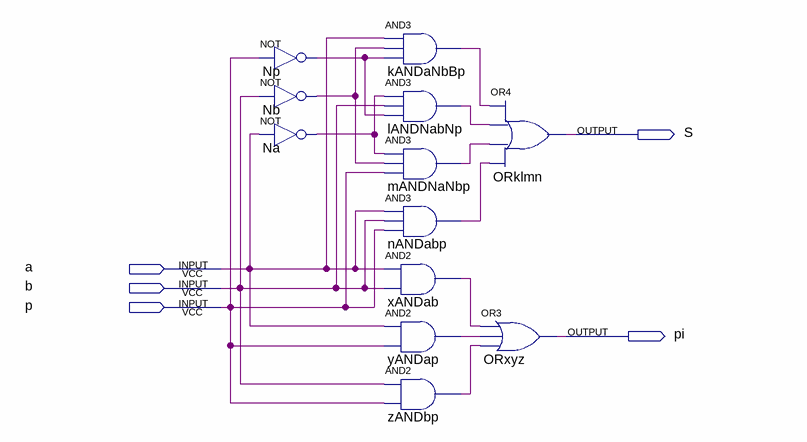
[diagram p0: schematic sheet]
// Quartus schematic sumAND_OR_N.bdf as structural Verilog: 12 symbols, 5 pins
module sumAND_OR_N (
  input  a,
  input  b,
  input  p,
  output S,
  output pi
);

  wire kANDaNbBp_out, lANDNabNp_out, mANDNaNbp_out, Na_out, nANDabp_out, Nb_out, Np_out, xANDab_out,
       yANDap_out, zANDbp_out;

  not Np (Np_out, p);
  not Nb (Nb_out, b);
  not Na (Na_out, a);
  and kANDaNbBp (kANDaNbBp_out, a, Nb_out, Np_out);
  and lANDNabNp (lANDNabNp_out, Na_out, b, Np_out);
  and mANDNaNbp (mANDNaNbp_out, Na_out, Nb_out, p);
  and nANDabp (nANDabp_out, a, b, p);
  and xANDab (xANDab_out, a, b);
  and yANDap (yANDap_out, a, p);
  and zANDbp (zANDbp_out, b, p);
  or ORklmn (S, kANDaNbBp_out, lANDNabNp_out, mANDNaNbp_out, nANDabp_out);
  or ORxyz (pi, xANDab_out, yANDap_out, zANDbp_out);
endmodule
